# Altium schematic sheet Index.SchDoc: Bluetooth Gateway
size A; CheckedBy: QUOCTHANG; DrawnBy: DONGKHOA; Revision: V1.0.0; SheetNumber: 4; SheetTotal: 10
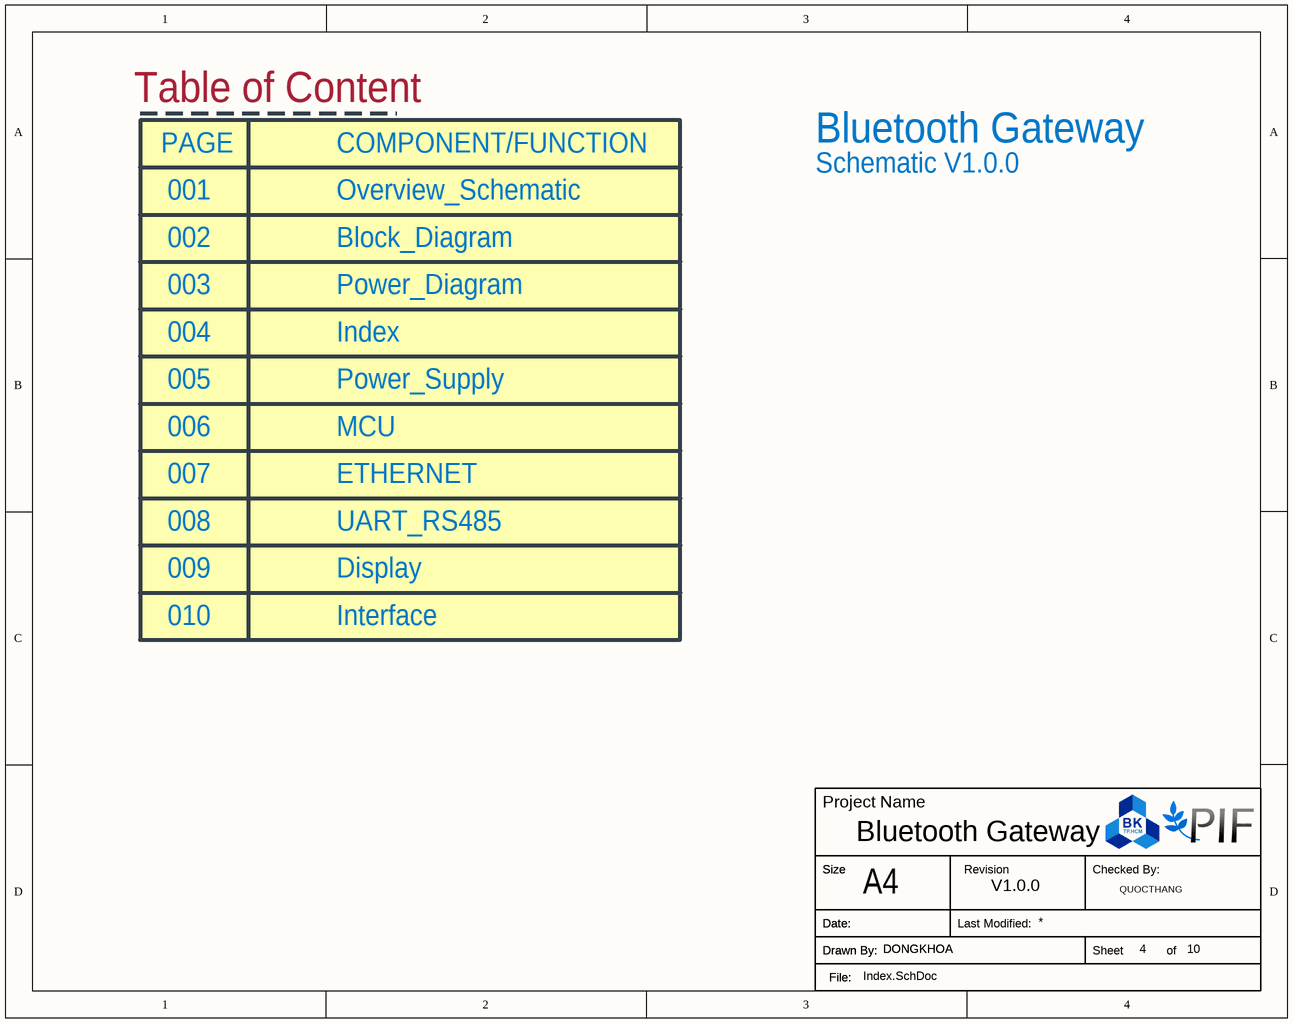
[diagram p0: Index.SchDoc]

## Notes on the sheet
- Table of Content
- PAGE
- COMPONENT/FUNCTION
- Bluetooth Gateway
- 001
- Overview_Schematic
- Schematic V1.0.0
- 002
- 003
- Block_Diagram
- Power_Diagram
- 004
- Index
- 005
- Power_Supply
- 006
- 007
- MCU
- ETHERNET
- 008
- UART_RS485
- 009
- 010
- Display
- Interface
- Project Name
- Size
- A4
- Revision
- Checked By:
- Drawn By:
- Date:
- File:
- Last Modified:
- Sheet
- of